# Altium schematic sheet Power_Supply.SchDoc
size A3; Author: Adriano et Luis; Organization: ETML-ES; Address1: Avenue Recordon 1; Address2: 1004 Lausanne; Address3: Switzerland; Revision: 1; SheetNumber: 3; SheetTotal: 6
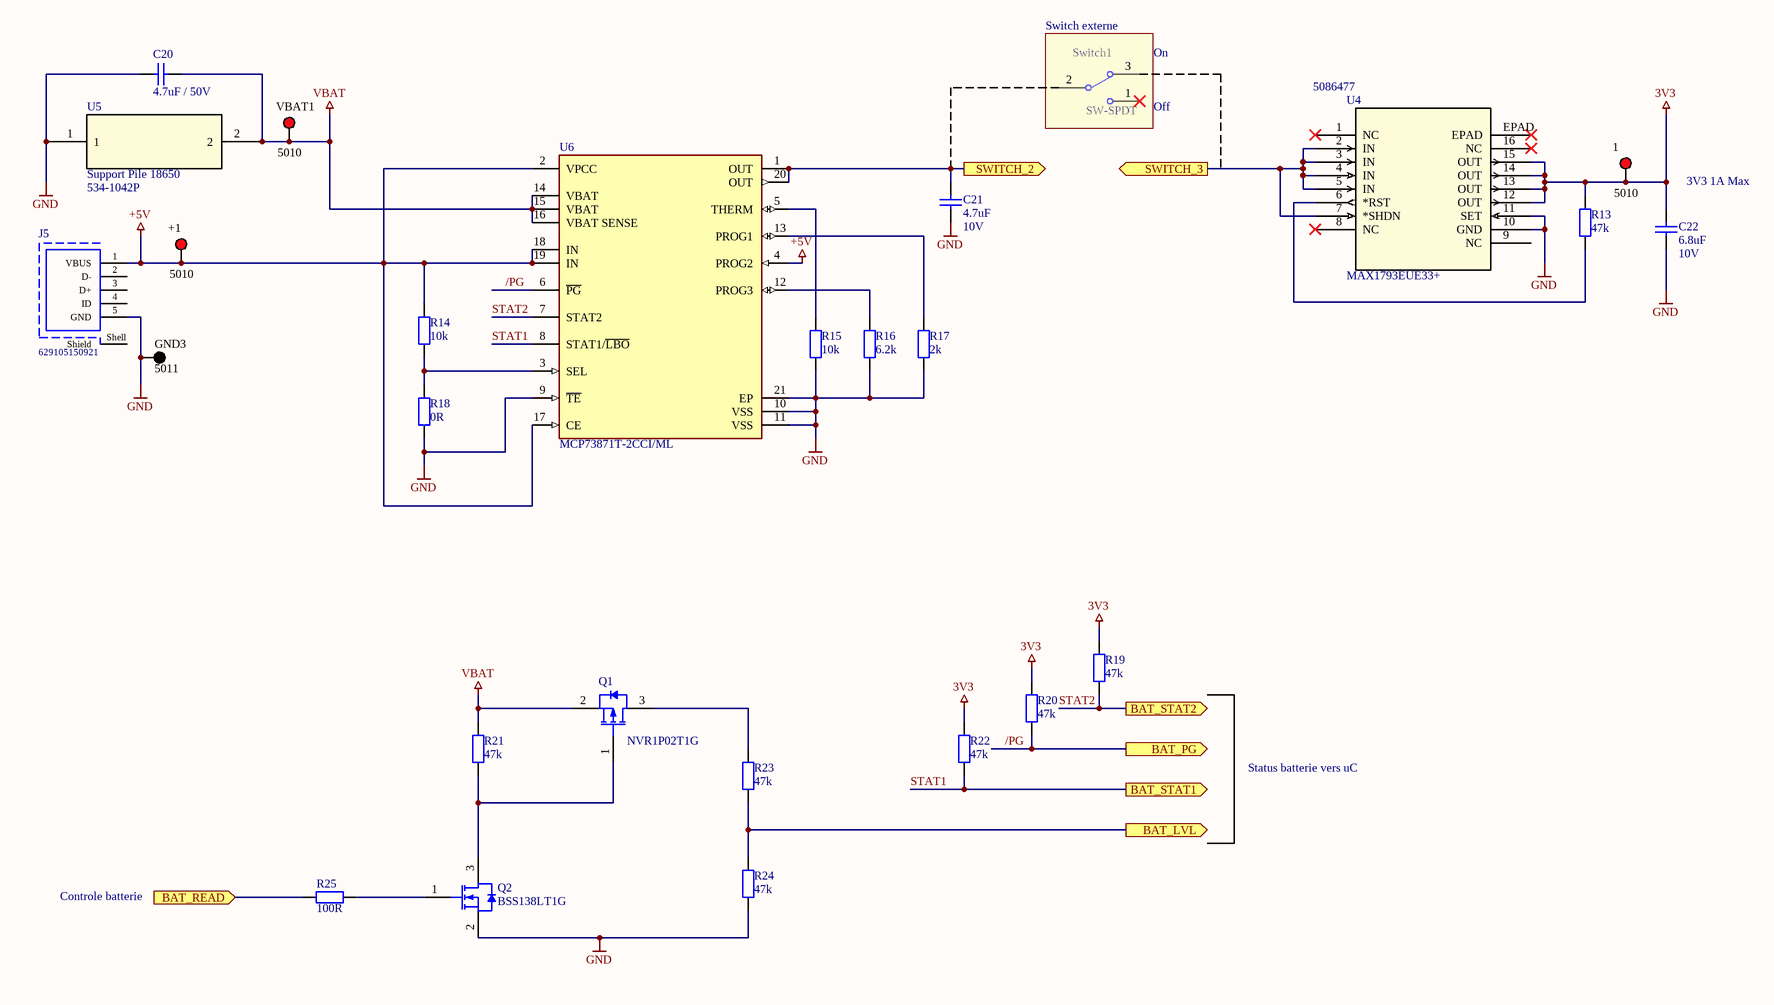
[diagram p0: Power_Supply.SchDoc]

## Parts
1  5010  [KSTN-5010_V]
+1  5010  [KSTN-5010_V]
C20  4.7uF / 50V  [CAPC0805]
C21  value 4.7uF  Tension: 10V  [CAPC0805]  (hidden comment: Cap)
C22  value 6.8uF  Tension: 10V  [CAPC0805]  (hidden comment: Cap)
GND3  5011  [KSTN-5011_V]
J5  629105150921  [629105150921]
Q1  NVR1P02T1G  [ONSC-SOT-23-3-318-08_V]
Q2  BSS138LT1G  [ONSC-SOT-23-3-318-08_V]
R13  value 47k  [RESC0805]  (hidden comment: VALUE)
R14  value 10k  [RESC0805]  (hidden comment: VALUE)
R15  value 10k  [RESC0805]  (hidden comment: VALUE)
R16  value 6.2k  [RESC0805]  (hidden comment: VALUE)
R17  value 2k  [RESC0805]  (hidden comment: VALUE)
R18  value 0R  [RESC0805]  (hidden comment: VALUE)
R19  value 47k  [RESC0805]  (hidden comment: VALUE)
R20  value 47k  [RESC0805]  (hidden comment: VALUE)
R21  value 47k  [RESC0805]  (hidden comment: VALUE)
R22  value 47k  [RESC0805]  (hidden comment: VALUE)
R23  value 47k  [RESC0805]  (hidden comment: VALUE)
R24  value 47k  [RESC0805]  (hidden comment: VALUE)
R25  value 100R  [RESC0805]  (hidden comment: VALUE)
Switch1  SW-SPDT  [TL36WW15050]  (graphical)
U4  MAX1793EUE33+  Supplier Part Number 1: 5086477  [21-0108_U16E+3_MXM]
U5  Support Pile 18650  Supplier Part Number 1: 534-1042P  [FP-1042P-MFG]
U6  MCP73871T-2CCI/ML  [FP-C04-126-IPC_C]
VBAT1  5010  [KSTN-5010_V]

## Blocks framed on the sheet
Switch externe: Switch1

## Ports
BAT_LVL (out), BAT_PG (out), BAT_READ (in), BAT_STAT1 (out), BAT_STAT2 (out), SWITCH_2 (out), SWITCH_3 (out)

## Nets
3V3: 1.1 C22.2 R13.2 R19.2 R20.2 R22.2 U4.12(OUT) U4.13(OUT) U4.14(OUT) U4.15(OUT)
+5V: +1.1 J5.1(VBUS) R14.2 U6.2(VPCC) U6.4(PROG2) U6.17(CE) U6.18(IN) U6.19(IN)
GND: C20.1 C21.1 C22.1 GND3.1 J5.5(GND) Q2.2(S) R15.1 R16.1 R17.1 R18.1 R24.1 U4.10(GND) U4.11(SET) U5.1 U6.9(~{TE}) U6.10(VSS) U6.11(VSS) U6.21(EP)
VBAT: C20.2 Q1.2(S) R21.1 U5.2 U6.14(VBAT) U6.15(VBAT) U6.16(VBAT_SENSE) VBAT1.1
/PG: R20.1 U6.6(~{PG}) ; port BAT_PG
BAT_LVL: R23.1 R24.2 ; port BAT_LVL
BAT_READ: R25.1 ; port BAT_READ
STAT1: R22.1 U6.8(STAT1/~{LBO}) ; port BAT_STAT1
STAT2: R19.1 U6.7(STAT2) ; port BAT_STAT2
SWITCH_2: C21.2 U6.1(OUT) U6.20(OUT) ; port SWITCH_2
SWITCH_3: U4.2(IN) U4.3(IN) U4.4(IN) U4.5(IN) U4.7(*SHDN) ; port SWITCH_3
NetQ1_1: Q1.1(G) Q2.3(D) R21.2
NetQ1_3: Q1.3(D) R23.2
NetQ2_1: Q2.1(G) R25.2
NetR13_1: R13.1 U4.6(*RST)
NetR14_1: R14.1 R18.2 U6.3(SEL)
NetR15_2: R15.2 U6.5(THERM)
NetR16_2: R16.2 U6.12(PROG3)
NetR17_2: R17.2 U6.13(PROG1)

Not connected (* = marked no-connect by the designer): J5 2(D-) 3(D+) 4(ID) Shell(Shield); Switch1 1* 2 3; U4 1(NC)* 8(NC)* 9(NC) 16(NC)* EPAD*

## Notes on the sheet
- (near Switch1) Off
- (near Switch1) On
- 3V3 1A Max
- Status batterie vers uC
- Controle batterie
- Fichier :
- a
- Date :
- Heure :
- Version :
- Auteur :
- Modif.
- b
- c
- d
- Projet :
- No :
- Nb feuilles
- Feuille n°
- Chemin :

## Library data of the parts
1 +1 VBAT1 = CMP-1672-00002-4: Test Point, Red, Through Hole, RoHS, Bulk; Manufacturer: Keystone; Contact Material: Bronze; Mounting Technology: Through Hole; RoHSCompliant: true; Pins: 1; Package Quantity: 100; ComponentLink2Description: Datasheet; Height: 8.12 mm; ComponentLink1URL: http://www.keyelco.com/; DatasheetVersion: Rev. F, 12/2013; Mount: Through Hole; PackageReference: 5010; Contact Plating: Silver; Packaging: Bulk; Colour: Red; REACH SVHC: No SVHC; PackageDescription: 1-Pin Through Hole Device, Dia 3.17 mm; ComponentLink2URL: http://www.keyelco.com/product-pdf.cfm?p=1319; ComponentLink1Description: Manufacturer URL
C20-C22 = Cap: Capacitor; Published: 8-Jun-2000; LatestRevisionDate: 17-Jul-2002; LatestRevisionNote: Re-released for DXP Platform.; PackageReference: RAD-0.3; Publisher: Altium Limited; PackageDescription: Radial Cap, Thru-Hole; 2 Leads; 0.3 in Pin Spacing
GND3 = CMP-1672-00003-4: Test Point, Black, Through Hole, RoHS, Bulk; Manufacturer: Keystone; ComponentLink2URL: http://www.keyelco.com/product-pdf.cfm?p=1320; Colour: Black; Pins: 1; REACH SVHC: No SVHC; ComponentLink1URL: http://www.keyelco.com/; PackageReference: 5011; Contact Plating: Silver; Package Quantity: 100; Packaging: Bulk; RoHSCompliant: true; Height: 8.12 mm; PackageDescription: 1-Pin Through Hole Device, Dia 3.17 mm; Mount: Through Hole; Mounting Technology: Through Hole; DatasheetVersion: Rev. F, 12/2013; ComponentLink1Description: Manufacturer URL; Contact Material: Bronze; ComponentLink2Description: Datasheet
J5 = CMP-1502-03249-1: Micro USB 2.0 Type AB Receptacle WR-COM, Horizontal, SMT; Manufacturer: Wurth Elektronik; Rated Current: 1.8A; Contact Resistance: 30mOhm; Working Voltage: 30VAC; Publisher: WurthElektronik; Part Number: 629105150921; Operating Temperature: -40to85degC; Gender: Receptacle; Packaging: TapeandReel; Connector Type: MicroUSB2.0TypeAB; Datasheet URL: https://katalog.we-online.de/em/datasheet/629105150921.pdf; Mounting Technology: SMT; Orientation: Horizontal; Package Reference: 629105150921; Manufacturer URL: http://www.we-online.de
Q1 = CMP-1058-00745-1: Power MOSFET, -20 V, -1 A, P-Channel, 3-Pin SOT-23, Pb-Free, Tape and Reel; Manufacturer: On Semiconductor; Ciss Typ (pF): 165; Configuration: Single; VGS(th) Max (V): 2.3; Channel Polarity: P Channel; V(BR)DSS Min (V): 20; ID Max (A): 1; Coss Typ (pF): 110; Qrr Typ (nC): 8; Crss Typ (pF): 35; PD Max (W): 0.4; DatasheetVersion: Rev. 7; ComponentLink1Description: Manufacturer URL; PackageReference: SOT-23-3-318-08; ComponentLink2Description: Datasheet; ComponentLink2URL: http://www.onsemi.cn/pub_link/Collateral/NTR1P02T1-D.PDF; Packing: Tape and Reel; Package Type: SOT-23-3; ComponentLink1URL: http://www.onsemi.com/; RoHS: Pb-Free; PartNumber: NVR1P02T1G; PackageVersion: Rev. AP, 11/2009; PackageDescription: 3-Pin Small Outline Transistor, Body 2.92 x 1.3 mm, Pitch 0.95 mm; ComponentLink3URL: http://www.onsemi.cn/pub_link/Collateral/318-08.PDF; ComponentLink3Description: Package Specification; VGS Max (V): 20; Mounting Technology: Surface Mount
Q2 = CMP-1058-00767-1: Power MOSFET, 200 mA, 50 V, N-Channel, 3-Pin SOT-23, Pb-Free, Tape and Reel; Manufacturer: On Semiconductor; PD Max (W): 0.225; Coss Typ (pF): 12; V(BR)DSS Min (V): 50; VGS Max (V): 20; Channel Polarity: N Channel; Configuration: Single; VGS(th) Max (V): 1.5; Ciss Typ (pF): 40; Crss Typ (pF): 3.5; ID Max (A): 0.2; ComponentLink3Description: Package Specification; PackageDescription: 3-Pin Small Outline Transistor, Body 2.92 x 1.3 mm, Pitch 0.95 mm; PackageReference: SOT-23-3-318-08; RoHS: Pb-Free; Mounting Technology: Surface Mount; ComponentLink1Description: Manufacturer URL; ComponentLink2URL: http://www.onsemi.com/pub_link/Collateral/BSS138LT1-D.PDF; ComponentLink2Description: Datasheet; Packing: Tape and Reel; PackageVersion: Rev. AP, 11/2009; PartNumber: BSS138LT1G; Package Type: SOT-23-3; ComponentLink1URL: http://www.onsemi.com/; DatasheetVersion: Rev. 8; ComponentLink3URL: http://www.onsemi.cn/pub_link/Collateral/318-08.PDF
R13-R25 = RES: Resistor
Switch1 = SW-SPDT: SPDT Subminiature Toggle Switch, Right Angle Mounting, Vertical Actuation; Published: 24-Mar-1999; LatestRevisionDate: 17-Dec-2003; LatestRevisionNote: Schematic revised, PCB Footprint replaced.; DatasheetVersion: 05-Dec-2000; PackageReference: TL36WW15050; Publisher: Altium Limited; PackageDescription: Switch; 4 Leads; ComponentLink1Description: Manufacturer Link; ComponentLink1URL: http://www.apem.com
U4 = MAX1793EUE33+: Fixed/Adjustable Positive LDO Regulator, 1.25V Min, 5V Max, 0.35V Dropout, PMOS, PDSO16; Mfr_Name: Maxim Integrated Products; Manufacturer 1: Maxim; Package Body Material: Plastic; Regulator Type: FIXED/ADJUSTABLE POSITIVE SINGLE OUTPUT LDO REGULATOR; Dropout Voltage1-Max: 350mV; Dropout Voltage1-Nom: 210mV; Input Voltage Absolute-Max: 6V; Line Regulation-Max: 0.0104%; Line Regulation-Max (%/V): 0.015; Number of Functions: 1; Output Current1-Max: 1A; Output Voltage1-Nom: 3.3V; Package Equivalence Code: TSSOP16,.25; Time @ Peak Reflow Temperature-Max (s): 30s; Voltage Tolerance-Max: 3%; Qualification Status: Not Qualified; Copyright: Copyright (C) 2021 Ultra Librarian. All rights reserved.; Manufacturer_Part_Number: MAX1793EUE33+; Digi-Key_Part_Number_1: MAX1793EUE33+-ND; RefDes: RefDes; Type: DEV; Supplier 1: Future Electronics; Manufacturer Part Number 1: MAX1793EUE33+; RoHS: Yes; Category: Voltage Regulators - Linear; Stock 1: 11; Pricing 1: 1=2,68000, 20=2,37000, 40=2,31000, 125=2,20000, 250=2,14000 (USD); Package Code: HTSSOP; Number of Pins: 16; Package Shape: Rectangular; Terminal Finish: Tin; Min Operating Temperature: 0°C; Max Operating Temperature: 85°C; Moisture Sensitivity Level: 1; JESD-609 Code: e3; Adjustability: FIXED/ADJUSTABLE; JESD-30 Code: R-PDSO-G16; Number of Outputs: 1; Operating Temperature, TJ-Max: 150°C; Output Voltage1-Max: 5V; Output Voltage1-Min: 1.25V; Package Style: SMALL OUTLINE, HEAT SINK/SLUG, THIN PROFILE, SHRINK PITCHMeter; Peak Reflow Temperature (Cel): 260°C; Surface Mount: Yes; Technology: PMOS; Terminal Form: Gull Wing; Terminal Position: DUAL; Length: 5mm; Width: 4.4mm; Height - Seated (Max): 1.1mm; Terminal Pitch: 0.65mm; REACH SVHC: Yes; RoHS Compliant: Yes; ComponentLink1URL: https://datasheet.ciiva.com:443/pdfs/VipMasterIC/IC/MAXM/MAXMS12433/MAXMS12433-1.pdf?src-supplier=IHS+Markit; ComponentLink1Description: https://datasheet.ciiva.com:443/pdfs/VipMasterIC/IC/MAXM/MAXMS12433/MAXMS12433-1.pdf?src-supplier=IHS+Markit; ComponentLink2URL: https://datasheet.ciiva.com/2051/max1793-2051488.pdf?src-supplier=Digi-Key; ComponentLink2Description: https://datasheet.ciiva.com/2051/max1793-2051488.pdf?src-supplier=Digi-Key; ComponentLink3URL: https://datasheet.ciiva.com/26903/max1793eue33-26903273.pdf?src-supplier=IIIC; ComponentLink3Description: https://datasheet.ciiva.com/26903/max1793eue33-26903273.pdf?src-supplier=IIIC; ComponentLink4URL: https://datasheet.ciiva.com/4887/max1793-45937-4887771.pdf?src-supplier=Mouser; ComponentLink4Description: https://datasheet.ciiva.com/4887/max1793-45937-4887771.pdf?src-supplier=Mouser; ComponentLink5URL: https://datasheet.ciiva.com/14282/max1793-14282095.pdf?src-supplier=Avnet; ComponentLink5Description: https://datasheet.ciiva.com/14282/max1793-14282095.pdf?src-supplier=Avnet
U5 = 1042P: No Description Available; Supplier 1: Mouser
U6 = CMP-06318-000014-1: IC USB/AC BATT CHRGR W/PPM 20QFN; Min Supply Voltage: 4.5V; Output Current: 1A; Output Voltage: 4.2V; Max Supply Voltage: 6V; Case/Package: QFN; RoHS Compliant: Yes; Min Operating Temperature: -40°C; Mount: Surface Mount; Package Quantity: 3300; Packaging: Tape and Reel; Number of Pins: 20; Max Operating Temperature: 85°C; Lead Free: Lead Free; Contact Plating: Tin